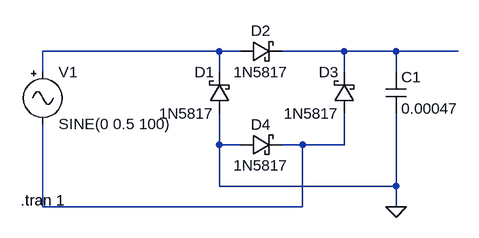
[diagram p0: schematic Brückenschaltung mit Kondensator.asc]
Brückenschaltung mit Kondensator.asc, the LTspice schematic file:
Version 4
SHEET 1 988 680
WIRE 608 160 336 160
WIRE 640 160 608 160
WIRE 800 160 704 160
WIRE 880 160 800 160
WIRE 976 160 880 160
WIRE 336 192 336 160
WIRE 608 192 608 160
WIRE 800 192 800 160
WIRE 880 192 880 160
WIRE 608 304 608 256
WIRE 640 304 608 304
WIRE 736 304 704 304
WIRE 800 304 800 256
WIRE 800 304 736 304
WIRE 608 368 608 304
WIRE 880 368 880 256
WIRE 880 368 608 368
WIRE 336 400 336 272
WIRE 736 400 736 304
WIRE 736 400 336 400
WIRE 880 400 880 368
FLAG 880 400 0
SYMBOL Misc\\signal 336 176 R0
WINDOW 123 0 0 Left 2
WINDOW 39 0 0 Left 2
SYMATTR InstName V1
SYMATTR Value SINE(0 0.5 100)
SYMBOL schottky 624 256 R180
WINDOW 0 24 64 Left 2
WINDOW 3 24 0 Left 2
SYMATTR InstName D1
SYMATTR Value 1N5817
SYMATTR Description Diode
SYMATTR Type diode
SYMBOL schottky 640 176 R270
WINDOW 0 32 32 VTop 2
WINDOW 3 0 32 VBottom 2
SYMATTR InstName D2
SYMATTR Value 1N5817
SYMATTR Description Diode
SYMATTR Type diode
SYMBOL schottky 816 256 R180
WINDOW 0 24 64 Left 2
WINDOW 3 24 0 Left 2
SYMATTR InstName D3
SYMATTR Value 1N5817
SYMATTR Description Diode
SYMATTR Type diode
SYMBOL schottky 640 320 R270
WINDOW 0 32 32 VTop 2
WINDOW 3 0 32 VBottom 2
SYMATTR InstName D4
SYMATTR Value 1N5817
SYMATTR Description Diode
SYMATTR Type diode
SYMBOL cap 864 192 R0
SYMATTR InstName C1
SYMATTR Value 0.00047
TEXT 302 390 Left 2 !.tran 1

The netlist it stands for:
* Brückenschaltung mit Kondensator.asc
V1 N001 N003 SINE(0 0.5 100)
D1 0 N001 1N5817
D2 N001 N002 1N5817
D3 N003 N002 1N5817
D4 0 N003 1N5817
C1 N002 0 0.00047
.model D D
.lib standard.dio
.tran 1
.backanno
.end